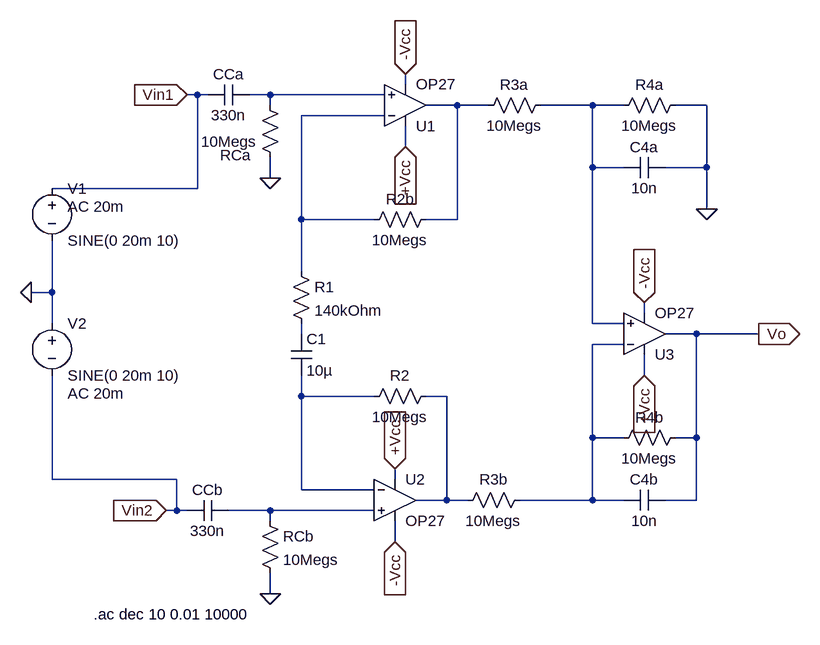
[diagram p0: schematic Instrument SMedits.asc]
Instrument SMedits.asc, the LTspice schematic file:
Version 4.1
SHEET 1 1320 680
WIRE 256 -288 256 -304
WIRE -64 -272 -80 -272
WIRE -48 -272 -64 -272
WIRE 48 -272 16 -272
WIRE 224 -272 48 -272
WIRE 48 -256 48 -272
WIRE 336 -256 288 -256
WIRE 384 -256 336 -256
WIRE 544 -256 464 -256
WIRE 592 -256 544 -256
WIRE 720 -256 672 -256
WIRE 224 -240 96 -240
WIRE 256 -192 256 -224
WIRE 544 -160 544 -256
WIRE 592 -160 544 -160
WIRE 720 -160 720 -256
WIRE 720 -160 656 -160
WIRE 48 -144 48 -176
WIRE -64 -128 -64 -272
WIRE -64 -128 -288 -128
WIRE 720 -96 720 -160
WIRE 96 -80 96 -240
WIRE 208 -80 96 -80
WIRE 336 -80 336 -256
WIRE 336 -80 288 -80
WIRE 96 0 96 -80
WIRE -288 32 -288 -48
WIRE -288 32 -320 32
WIRE 624 64 624 48
WIRE -288 80 -288 32
WIRE 544 80 544 -160
WIRE 592 80 544 80
WIRE 96 96 96 80
WIRE 704 96 656 96
WIRE 800 96 704 96
WIRE 592 112 544 112
WIRE 624 160 624 128
WIRE 96 192 96 160
WIRE 208 192 96 192
WIRE 320 192 288 192
WIRE 544 256 544 112
WIRE 592 256 544 256
WIRE 704 256 704 96
WIRE 704 256 672 256
WIRE -288 320 -288 160
WIRE -96 320 -288 320
WIRE 240 320 240 304
WIRE 96 336 96 192
WIRE 208 336 96 336
WIRE 320 352 320 192
WIRE 320 352 272 352
WIRE 352 352 320 352
WIRE 544 352 544 256
WIRE 544 352 432 352
WIRE 592 352 544 352
WIRE 704 352 704 256
WIRE 704 352 656 352
WIRE -96 368 -96 320
WIRE -96 368 -112 368
WIRE -80 368 -96 368
WIRE 48 368 -16 368
WIRE 208 368 48 368
WIRE 48 384 48 368
WIRE 240 416 240 384
WIRE 48 496 48 464
FLAG 48 -144 0
FLAG 48 496 0
FLAG 720 -96 0
FLAG -80 -272 Vin1
IOPIN -80 -272 In
FLAG -112 368 Vin2
IOPIN -112 368 In
FLAG 800 96 Vo
IOPIN 800 96 Out
FLAG 256 -304 -Vcc
IOPIN 256 -304 In
FLAG 240 416 -Vcc
IOPIN 240 416 In
FLAG 624 48 -Vcc
IOPIN 624 48 In
FLAG 256 -192 +Vcc
IOPIN 256 -192 In
FLAG 240 304 +Vcc
IOPIN 240 304 In
FLAG 624 160 +Vcc
IOPIN 624 160 In
FLAG -320 32 0
SYMBOL OP27 256 -192 M180
SYMATTR InstName U1
SYMBOL OP27 240 288 R0
SYMATTR InstName U2
SYMBOL OP27 624 160 M180
SYMATTR InstName U3
SYMBOL res 80 -16 R0
SYMATTR InstName R1
SYMATTR Value 140kOhm
SYMATTR SpiceLine tol=1
SYMBOL cap 80 96 R0
SYMATTR InstName C1
SYMATTR Value 10µ
SYMBOL res 304 176 R90
WINDOW 0 0 56 VBottom 2
WINDOW 3 32 56 VTop 2
SYMATTR InstName R2
SYMATTR Value 10Megs
SYMBOL res 448 336 R90
WINDOW 0 0 56 VBottom 2
WINDOW 3 32 56 VTop 2
SYMATTR InstName R3b
SYMATTR Value 10Megs
SYMATTR SpiceLine tol=1
SYMBOL res 480 -272 R90
WINDOW 0 0 56 VBottom 2
WINDOW 3 32 56 VTop 2
SYMATTR InstName R3a
SYMATTR Value 10Megs
SYMATTR SpiceLine tol=1
SYMBOL res 304 -96 R90
WINDOW 0 0 56 VBottom 2
WINDOW 3 32 56 VTop 2
SYMATTR InstName R2b
SYMATTR Value 10Megs
SYMATTR SpiceLine tol=1
SYMBOL res 64 -160 R180
WINDOW 0 45 19 Left 2
WINDOW 3 36 40 Left 2
SYMATTR InstName RCa
SYMATTR Value 10Megs
SYMBOL cap 16 -288 R90
WINDOW 0 0 32 VBottom 2
WINDOW 3 32 32 VTop 2
SYMATTR InstName CCa
SYMATTR Value 330n
SYMBOL cap -16 352 R90
WINDOW 0 0 32 VBottom 2
WINDOW 3 32 32 VTop 2
SYMATTR InstName CCb
SYMATTR Value 330n
SYMBOL res 32 368 R0
SYMATTR InstName RCb
SYMATTR Value 10Megs
SYMBOL res 688 240 R90
WINDOW 0 0 56 VBottom 2
WINDOW 3 32 56 VTop 2
SYMATTR InstName R4b
SYMATTR Value 10Megs
SYMATTR SpiceLine tol=1
SYMBOL cap 656 336 R90
WINDOW 0 0 32 VBottom 2
WINDOW 3 32 32 VTop 2
SYMATTR InstName C4b
SYMATTR Value 10n
SYMBOL res 688 -272 R90
WINDOW 0 0 56 VBottom 2
WINDOW 3 32 56 VTop 2
SYMATTR InstName R4a
SYMATTR Value 10Megs
SYMATTR SpiceLine tol=1
SYMBOL cap 656 -176 R90
WINDOW 0 0 32 VBottom 2
WINDOW 3 32 32 VTop 2
SYMATTR InstName C4a
SYMATTR Value 10n
SYMBOL voltage -288 -144 R0
WINDOW 123 24 44 Left 2
WINDOW 39 0 0 Left 0
SYMATTR Value2 AC 20m
SYMATTR InstName V1
SYMATTR Value SINE(0 20m 10)
SYMBOL voltage -288 64 R0
WINDOW 123 24 124 Left 2
WINDOW 39 0 0 Left 0
SYMATTR Value2 AC 20m
SYMATTR InstName V2
SYMATTR Value SINE(0 20m 10)
TEXT -224 528 Left 2 !.ac dec 10 0.01 10000

The netlist it stands for:
* Instrument SMedits.asc
X§U1 N001 N004 +Vcc -Vcc N002 OP27  ; pins In+ In- V+ V- OUT
X§U2 N009 N007 +Vcc -Vcc N008 OP27  ; pins In+ In- V+ V- OUT
X§U3 N003 N006 +Vcc -Vcc Vo OP27  ; pins In+ In- V+ V- OUT
R1 N004 N005 140kOhm tol=1
C1 N005 N007 10µ
R2 N008 N007 10Megs
R3b N006 N008 10Megs tol=1
R3a N003 N002 10Megs tol=1
R2b N002 N004 10Megs tol=1
RCa 0 N001 10Megs
CCa N001 Vin1 330n
CCb N009 Vin2 330n
RCb N009 0 10Megs
R4b Vo N006 10Megs tol=1
C4b Vo N006 10n
R4a 0 N003 10Megs tol=1
C4a 0 N003 10n
V1 Vin1 0 SINE(0 20m 10) AC 20m
V2 0 Vin2 SINE(0 20m 10) AC 20m
.ac dec 10 0.01 10000
.lib ADI.lib
.backanno
.end